# Altium project Adapter-LEDs.PrjPCB
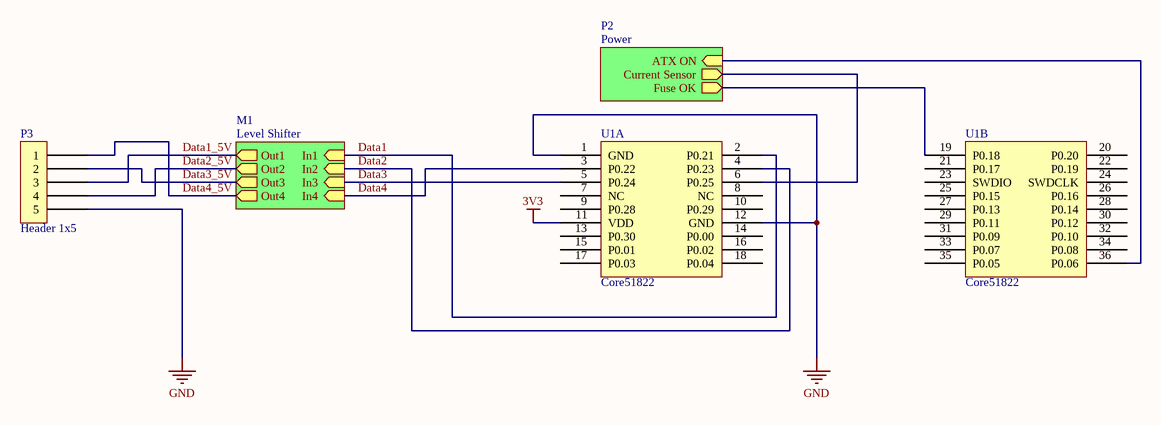
[diagram p0: Top.SchDoc]
3 sheets, 22 parts. Net scope: hierarchical (ports join the sheet entries above them; power ports are global).
Board file: Adapter.PcbDoc
Sheets:
  Top.SchDoc
    M1 = Level Shifter.SchDoc
    P2 = Power.SchDoc

## Sheet Top.SchDoc
size A4

### Parts
P3  Header 1x5  [Header 1x5 male]
U1  Core51822  [Core51822]  (parts A,B of 2)

### Sub-sheets
M1 = Level Shifter: In1 (in), In4 (in), In3 (in), In2 (in), Out1 (out), Out3 (out), Out2 (out), Out4 (out)
P2 = Power: Current Sensor (out), Fuse OK (out), ATX ON (in)

### Nets
3V3: U1.11(VDD)
GND: P3.5 U1.1(GND) U1.12(GND)
ATX ON: U1.36(P0.06) ; sheet P2/ATX ON
Current Sensor: U1.6(P0.25) ; sheet P2/Current Sensor
Data1: U1.2(P0.21) ; sheet M1/In1
Data1_5V: P3.3 ; sheet M1/Out1
Data2: U1.4(P0.23) ; sheet M1/In2
Data2_5V: P3.4 ; sheet M1/Out2
Data3: U1.5(P0.24) ; sheet M1/In3
Data3_5V: P3.2 ; sheet M1/Out3
Data4: U1.3(P0.22) ; sheet M1/In4
Data4_5V: P3.1 ; sheet M1/Out4
Fuse OK: U1.19(P0.18) ; sheet P2/Fuse OK

Not connected (* = marked no-connect by the designer): U1 7(NC) 8(NC) 9(P0.28) 10(P0.29) 13(P0.30) 14(P0.00) 15(P0.01) 16(P0.02) 17(P0.03) 18(P0.04) 20(P0.20) 21(P0.17) 22(P0.19) 23(SWDIO) 24(SWDCLK) 25(P0.15) 26(P0.16) 27(P0.13) 28(P0.14) 29(P0.11) 30(P0.12) 31(P0.09) 32(P0.10) 33(P0.07) 34(P0.08) 35(P0.05)

## Sheet Level Shifter.SchDoc
size A4
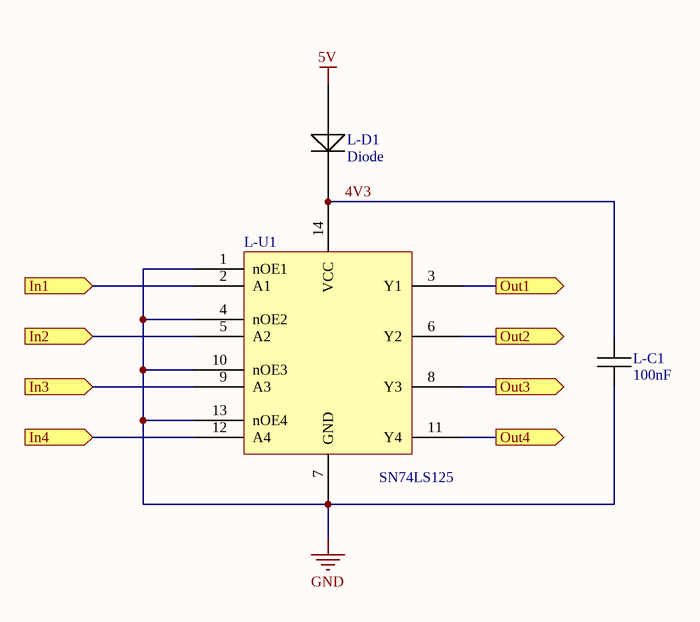
[diagram p1: Level Shifter.SchDoc]

### Parts
L-C1  100nF  [C 0805 / 2012]
L-D1  Diode  [DO-41]
L-U1  SN74LS125  [DIP-14]

### Ports
In1 (in), In2 (in), In3 (in), In4 (in), Out1 (out), Out2 (out), Out3 (out), Out4 (out)

### Nets
5V: L-D1.2
GND: L-C1.2 L-U1.1(nOE1) L-U1.4(nOE2) L-U1.7(GND) L-U1.10(nOE3) L-U1.13(nOE4)
4V3: L-C1.1 L-D1.1 L-U1.14(VCC)
Data1: L-U1.2(A1) ; port In1
Data1_5V: L-U1.3(Y1) ; port Out1
Data2: L-U1.5(A2) ; port In2
Data2_5V: L-U1.6(Y2) ; port Out2
Data3: L-U1.9(A3) ; port In3
Data3_5V: L-U1.8(Y3) ; port Out3
Data4: L-U1.12(A4) ; port In4
Data4_5V: L-U1.11(Y4) ; port Out4

### Library data of the parts
L-C1 = Capacitor
L-U1 = 74xx125: Quad 3-State Buffers

## Sheet Power.SchDoc
size A4
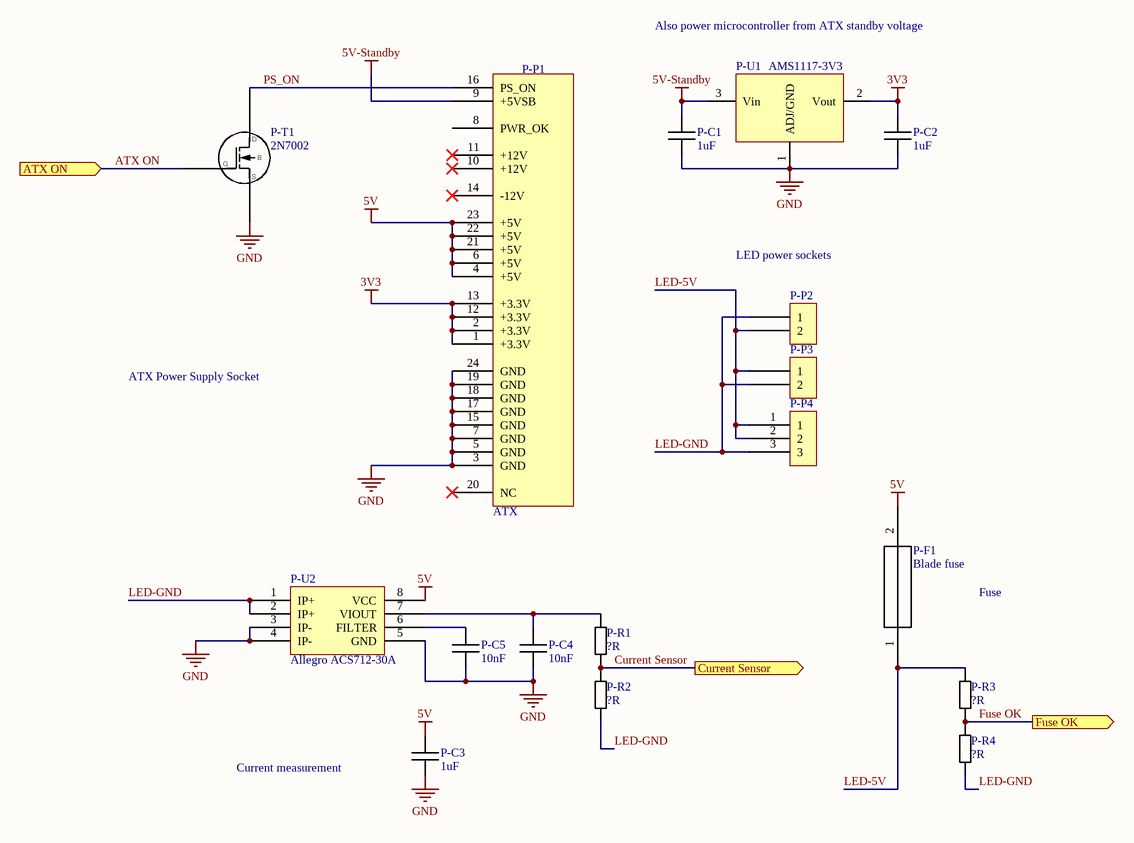
[diagram p2: Power.SchDoc]

### Parts
P-C1  1uF  [C 0805 / 2012]
P-C2  1uF  [C 0805 / 2012]
P-C3  1uF  [C 0805 / 2012]
P-C4  10nF  [R 0805 / 2012 wide]
P-C5  10nF  [C 0805 / 2012]
P-F1  Blade fuse  [Blade fuse receptacle]
P-P1  ATX  [ATX]
P-P2  Header 2x1  [Screw terminal 2 pin RM 5mm]  (value not drawn)
P-P3  Header 2x1  [Screw terminal 2 pin RM 5mm]  (value not drawn)
P-P4  Header 1x3  [Screw terminal 3 pin RM 7.62mm]  (value not drawn)
P-R1  ?R  [R 0805 / 2012]
P-R2  ?R  [R 0805 / 2012]
P-R3  ?R  [R 0805 / 2012]
P-R4  ?R  [R 0805 / 2012]
P-T1  2N7002  [SOT-23-3]
P-U1  AMS1117-3V3  [SOT-223-3]
P-U2  Allegro ACS712-30A  [SOIC-8]

### Ports
ATX ON (in), Current Sensor (out), Fuse OK (out)

### Nets
3V3: P-C2.1 P-P1.1(+3.3V) P-P1.2(+3.3V) P-P1.12(+3.3V) P-P1.13(+3.3V) P-U1.2(Vout)
5V: P-C3.1 P-F1.2 P-P1.4(+5V) P-P1.6(+5V) P-P1.21(+5V) P-P1.22(+5V) P-P1.23(+5V) P-U2.8(VCC)
5V-Standby: P-C1.1 P-P1.9(+5VSB) P-U1.3(Vin)
GND: P-C1.2 P-C2.2 P-C3.2 P-C4.2 P-C5.2 P-P1.3(GND) P-P1.5(GND) P-P1.7(GND) P-P1.15(GND) P-P1.17(GND) P-P1.18(GND) P-P1.19(GND) P-P1.24(GND) P-T1.2 P-U1.1(ADJ/GND) P-U2.3(IP-) P-U2.4(IP-) P-U2.5(GND)
ATX ON: P-T1.1 ; port ATX ON
Current Sensor: P-R1.1 P-R2.2 ; port Current Sensor
Fuse OK: P-R3.1 P-R4.2 ; port Fuse OK
LED-5V: P-F1.1 P-P2.2 P-P3.1 P-P4.1 P-P4.2 P-R3.2
LED-GND: P-P2.1 P-P3.2 P-P4.3 P-R2.1 P-R4.1 P-U2.1(IP+) P-U2.2(IP+)
PS_ON: P-P1.16(PS_ON) P-T1.3
NetP-C4_1: P-C4.1 P-R1.2 P-U2.7(VIOUT)
NetP-C5_1: P-C5.1 P-U2.6(FILTER)

Not connected (* = marked no-connect by the designer): P-P1 8(PWR_OK) 10(+12V)* 11(+12V)* 14(-12V)* 20(NC)*

### Notes on the sheet
- Also power microcontroller from ATX standby voltage
- LED power sockets
- ATX Power Supply Socket
- Fuse
- Current measurement

### Library data of the parts
P-C1-P-C5 = Capacitor
P-F1 = Fuse
P-P1 = ATX sorted
P-R1-P-R4 = Resistor
P-T1 = 2N7002: N-FET
P-U1 = AMS1117: LDO 3.3V/5V/12V
P-U2 = Allegro ACS712: Analog current sensor

## Nets that join several sheets
3V3: Top (U1.11), Power (6 pins)
5V: Level Shifter (L-D1.2), Power (8 pins)
GND: Top (P3.5 U1.1 U1.12), Level Shifter (6 pins), Power (18 pins)
ATX ON: Top (U1.36), Power (P-T1.1)
Current Sensor: Top (U1.6), Power (P-R1.1 P-R2.2)
Data1: Top (U1.2), Level Shifter (L-U1.2)
Data1_5V: Top (P3.3), Level Shifter (L-U1.3)
Data2: Top (U1.4), Level Shifter (L-U1.5)
Data2_5V: Top (P3.4), Level Shifter (L-U1.6)
Data3: Top (U1.5), Level Shifter (L-U1.9)
Data3_5V: Top (P3.2), Level Shifter (L-U1.8)
Data4: Top (U1.3), Level Shifter (L-U1.12)
Data4_5V: Top (P3.1), Level Shifter (L-U1.11)
Fuse OK: Top (U1.19), Power (P-R3.1 P-R4.2)